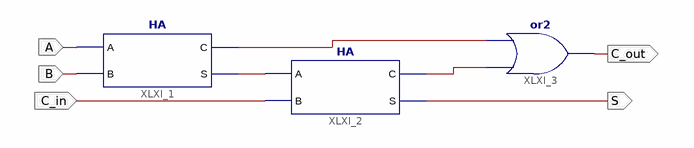
[diagram p0: schematic sheet 1]
// Xilinx ISE schematic FA.sch (spartan3e) as structural Verilog: 3 symbols, 5 ports
module FA (
  input  A,
  input  B,
  input  C_in,
  output S,
  output C_out
);

  wire XLXN_2, XLXN_3, XLXN_4;

  HA XLXI_1 (.A(A), .B(B), .C(XLXN_3), .S(XLXN_2));
  HA XLXI_2 (.A(XLXN_2), .B(C_in), .C(XLXN_4), .S(S));
  or XLXI_3 (C_out, XLXN_4, XLXN_3);
endmodule
